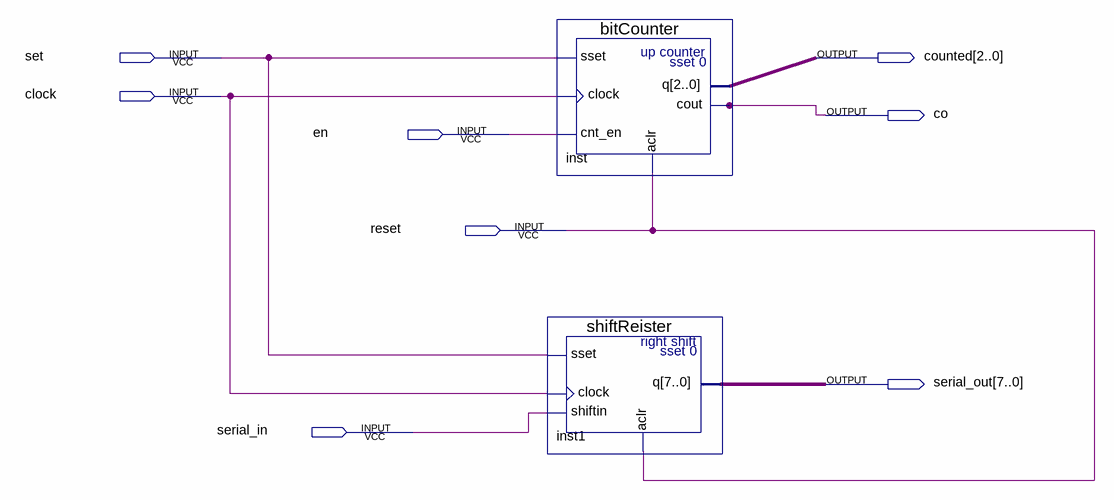
[diagram p0: schematic sheet]
// Quartus schematic counterRegister.bdf as structural Verilog: 2 symbols, 8 pins
module counterRegister (
  input  set,
  input  clock,
  input  en,
  input  reset,
  input  serial_in,
  output [2:0] counted,
  output co,
  output [7:0] serial_out
);

  bitCounter inst (.sset(set), .clock(clock), .cnt_en(en), .aclr(reset), .cout(co), .q(counted));
  shiftReister inst1 (.sset(set), .clock(clock), .shiftin(serial_in), .aclr(reset), .q(serial_out));
endmodule
